# Altium project SpaceSystemsTaskII.PrjPcb
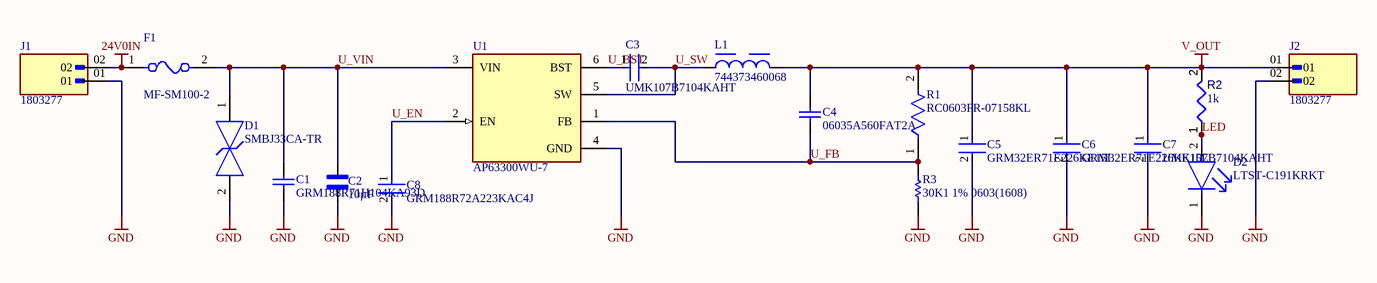
[diagram p0: Sheet2.SchDoc]
1 sheet, 18 parts. Net scope: global (net labels, ports and power ports of the same name join across sheets).
Board file: PCB_II.PcbDoc

## Sheet Sheet2.SchDoc
size A4; SheetNumber: 1; SheetTotal: 1

### Parts
C1  GRM188R71H104KA93D  [CAPC1608X90X35ML10T15]
C2  value 10µF  [CAPC3216X180N]  (hidden comment: GRM31CR71E106KA12L)
C3  UMK107B7104KAHT  [FP-0603-L_1_6_0_1-W_0_8_0-IPC_B]
C4  06035A560FAT2A  [CAPC1608X90X35NL15T15]
C5  GRM32ER71E226KE15L  [FP-GRM32E-0_3-0_2-MFG]
C6  GRM32ER71E226KE15L  [FP-GRM32E-0_3-0_2-MFG]
C7  UMK107B7104KAHT  [FP-0603-L_1_6_0_1-W_0_8_0-IPC_B]
C8  GRM188R72A223KAC4J  [FP-GRM188-0_1-e0_2_0_5-MFG]
D1  SMBJ33CA-TR  [FP-SMB-CA-MFG]
D2  LTST-C191KRKT  [FP-LTST-C191KRKT-MFG]
F1  MF-SM100-2  [FP-MF-SM100-2-MFG]
J1  1803277  [PHOENIX_1803277]
J2  1803277  [PHOENIX_1803277]
L1  744373460068  [WE-LHMI_7030]
R1  RC0603FR-07158KL  [FP-RC0603-0_55-MFG]
R2  value 1k  [RESC1608X55X25ML10T15]  (hidden comment: Resistor 1k +/-1% 0603 100 mW)
R3  30K1 1% 0603(1608)  [RESC0603(1608)_N]
U1  AP63300WU-7  [FP-TSOT26-IPC_A]

### Nets
24V0IN: F1.1 J1.02
GND: C1.1 C2.1 C5.2 C6.2 C7.2 C8.2 D1.2 D2.1(C) J1.01 J2.02 R3.1 U1.4(GND)
V_OUT: C4.2 C5.1 C6.1 C7.1 J2.01 L1.2 R1.2 R2.2
LED: D2.2(A) R2.1
U_BST: C3.1 U1.6(BST)
U_EN: C8.1 U1.2(EN)
U_FB: C4.1 R1.1 R3.2 U1.1(FB)
U_SW: C3.2 L1.1 U1.5(SW)
U_VIN: C1.2 C2.2 D1.1 F1.2 U1.3(VIN)

### Library data of the parts
C1 = CMP-2100-03643-1: Chip Capacitor, 0.1 uF, +/- 10%, 50 V, -55 to 125 degC, 0603 (1608 Metric), RoHS, Tape and Reel; Manufacturer: Murata; Dielectric Material: Ceramic; Voltage Rating: 50V; Capacitance: 100nF; Dielectric: X7R; Insulation Resistance: 10GR; Case Code (Metric): 1608; Lead Free: LeadFree; Depth: 0.8mm; Number of Pins: 2; Radiation Hardening: No; Case/Package: 0603; Manufacturer URL: http://www.murata.com/; Packaging: TapeandReel; Length: 1.6mm; Contact Plating: Tin; Datasheet URL: http://psearch.en.murata.com/capacitor/product/GRM188R71H104KA93%23.pdf; Tolerance: 10%; Case Code (Imperial): 0603; Min Operating Temperature: -55degC; RoHSCompliant: true; Voltage: 50V; Termination: SMD/SMT; Mount: SurfaceMount; Material: Ceramic; Package Quantity: 1; Height: 0.8mm; Thickness: 0.035inch; REACH SVHC: NoSVHC; Max Operating Temperature: 125degC; Width: 0.8mm; Package Reference: 0603; Voltage Rating (DC): 50V; Datasheet Version: 42675.0; Package Description: 2-Pin Surface Mount Device, Body 1.6 x 0.8 mm
C2 = CMP-001-00083-1: SMD capacitor X7R(EIA) with capacitance 10uF Tol.10%. Rated voltage 25Vdc 125C; MF: Murata Electronics; Design Item ID: GRM31CR71E106KA12L; Check_prices: https://www.snapeda.com/parts/GRM31CR71E106KA12L/Murata+Electronics+North+America/view-part/?ref=eda; SnapEDA_Link: https://www.snapeda.com/parts/GRM31CR71E106KA12L/Murata+Electronics+North+America/view-part/?ref=snap; Pins: 2; Case/Package: 1206 Murata; Source: GRM31CR71E106KA12L.SchLib; MP: GRM31CR71E106KA12L; Component Type: Standard
C3 C7 = CMP-14477-002598-2: None; Capacitance: 100nF; Voltage Rating: 50V; Dielectric: X7R; Tolerance: 10%; Ratings: AEC-Q200; Length: 0.063inch; Package Quantity: 4000; Thickness: 0.035inch; Case/Package: 0603; Width: 0.8mm; Termination: SMD/SMT; Max Operating Temperature: 125°C; Voltage Rating (DC): 50V; Case Code (Imperial): 0603; RoHS Compliant: Yes; Mount: Surface Mount; Height: 0.8mm; Case Code (Metric): 1608; Min Operating Temperature: -55°C; Packaging: Tape and Reel; Halogen Free: Halogen Free; Lead Free: Lead Free
C4 = CMP-2006-04334-1: Manufacturer: AVX Interconnect / Elco; Part Number: 06035A560FAT2A
C5 C6 = CMP-1662-00021-2: Chip Multilayer Ceramic Capacitors for General Purpose, 1210, 22uF, X7R, 15%, 10%, 25V; Capacitance: 22uF; Lead Free: Lead Free; Depth: 2.5mm; Mount: Surface Mount; Termination: SMD/SMT; Radiation Hardening: No; Package Quantity: 1; Dielectric: X7R; REACH SVHC: No SVHC; Voltage: 25V; Voltage Rating: 25V; Case Code (Metric): 3225; Tolerance: 10%; Number of Pins: 2; Packaging: Tape and Reel; Thickness: 0.106inch; Min Operating Temperature: -55°C; Length: 3.2mm; Voltage Rating (DC): 25V; Width: 0.098inch; Height: 2.5mm; Case Code (Imperial): 1210; Max Operating Temperature: 125°C; Material: Ceramic; Case/Package: 1210
C8 = CMP-06035-008498-1: Chip Multilayer Ceramic Capacitors for General Purpose, 0603, 22000pF, X7R, 15%, 10%, 100V; Capacitance: 22nF; Width: 0.031inch; Package Quantity: 10000; Tolerance: 10%; Packaging: Tape and Reel; Max Operating Temperature: 125°C; Thickness: 0.035inch; Case/Package: 0603; Voltage Rating: 100V; Dielectric: X7R; Length: 0.063inch; Mount: Surface Mount; Min Operating Temperature: -55°C; Voltage Rating (DC): 100V; Weight: 0.000222oz
D1 = CMP-12225-000040-1: TVS DIODE 33V 69.7V SMB; Manufacturer: STMicroelectronics; Direction: Bidirectional; Peak Pulse Current: 11.8A; Peak Pulse Power: 600W; Clamping Voltage: 53.3V; Breakdown Voltage: 36.7V; Number Of Channels: 1; Standoff Height: 0.05mm; Max Junction Temp: +150°C; Lead Free: Yes; Device Class L1: Circuit Protection; Device Class L3: unset; Mouser Description: TVS Diodes - Transient Voltage Suppressors 600W 33V Bidirect; Device Class L2: TVS Diodes; Temperature Range High: +150°C; Temperature: -55°C to +150°C; Temperature Range Low: -55°C; Octopart: https://octopart.com/smbj33ca-tr-stmicroelectronics-347069; Manufacturer Part Number: SMBJ33CA-TR; Automotive: No; ComponentLink2URL: https://www.st.com/resource/en/datasheet/smbj.pdf; RoHS: TRUE; Package: SMB-CA; Category: Diode; ComponentLink2Description: Datasheet; Height: 2.65mm; Reverse Standoff Voltage: 33V; Digikey Description: TVS DIODE 33V 69.7V SMB
D2 = CMP-2000-05199-2: NexarPartId: 549908; Illumination Color: Red; Lens Transparency: Clear; Luminous Intensity: 54mcd; Current: 2A; Forward Current: 20mA; Number of Elements: 1; Power Rating: 75mW; Lens Color: Colorless; Wavelength: 639nm; Viewing Angle: 130°; Voltage: 2V; Dominant Wavelength: 631nm; Reverse Voltage: 5V; Height: 550µm; Length: 1.6mm; Number of Pins: 2; Packaging: Tape and Reel; Mount: Surface Mount; Case Code (Metric): 1608; Radiation Hardening: No; Case Code (Imperial): 0603; Test Current: 20mA; Number of LEDs: 1; Schedule B: 8541402000, 8541402000; Lead Free: Lead Free; Power Dissipation: 75mW; RoHS: Compliant; Forward Voltage: 2V; Lens Style: Clear; Color: Red; Max Operating Temperature: 85°C; Depth: 800µm; Width: 800µm; Min Operating Temperature: -55°C; Case/Package: 0603
F1 = CMP-07400-000033-1: PTC RESET FUSE 30V 1.1A 2SMD; Manufacturer: Bourns; Trip Time: 0.5s; Current Rating: 80A; Trip Current: 2.2A; Value: 0.12-0.48Ω; Automotive Grade: Grade 3; Digikey Description: PTC RESET FUSE 30V 1.1A 2SMD; Temperature Range Low: -40°C; Octopart: https://octopart.com/mf-sm100-2-bourns-125561; Lead Free: Yes; Device Class L2: PTC Resettable Fuses; Ambient Temperature Range Low: -40°C; Voltage Rating: 30V; Hold Current: 1.1A; RoHS: TRUE; Height: 3mm; ComponentLink2URL: https://www.bourns.com/docs/Product-Datasheets/mfsm.pdf; Resistance: 0.12-0.48Ω; Device Class L3: unset; Mouser Description: Resettable Fuses - PPTC 30Volts 80Amps Hold 1.1A Trip 2.2A; Device Class L1: Circuit Protection; Automotive: Yes; ComponentLink2Description: Datasheet; Temperature: -40°C to +85°C; Category: Fuse; Package: MF-SM100-2; Manufacturer Part Number: MF-SM100-2; Temperature Range High: +85°C; Ambient Temperature Range High: +85°C
J1 J2 = CMP-002-00071-1: Pluggable Header 3.81mm 16AWG 160V 8A 2 Position COMBICON MC Series; MF: Phoenix Contact; MP: 1803277; Check_prices: https://www.snapeda.com/parts/1803277/Phoenix+Contact/view-part/?ref=eda; Design Item ID: 1803277; Value: *; Case/Package: None; SnapEDA_Link: https://www.snapeda.com/parts/1803277/Phoenix+Contact/view-part/?ref=snap; Component Type: Standard; Pins: 2; Source: 1803277.SchLib
L1 = CMP-1353-00050-5: NexarPartId: 21272415; Inductance: 680nH; Shielding: Shielded; Saturation Current: 15.9A; Current Rating: 11A; Tolerance: 20%; Core Material: Composite, Ferrite; Series Resistance: 5.5mΩ; Frequency: 72MHz; DC Resistance (DCR): 4.8mΩ; Test Frequency: 100kHz; Min Operating Temperature: -40°C; Max Operating Temperature: 125°C; Width: 6.6mm; REACH SVHC: Unknown; Height - Seated (Max): 2.9972mm; RoHS: Compliant; Ambient Temperature Range Low: -40°C; Mount: Surface Mount; Depth: 6.6mm; Height: 2.8mm; Packaging: Tape & Reel (TR); RMS Current (Irms): 11A; Termination: SMD/SMT; Composition: Wirewound; Max DC Current: 11A; Length: 7.3mm; Self Resonant Frequency: 72MHz; Ambient Temperature Range High: 85°C; Case/Package: Nonstandard; Inductance Tolerance: 20%; Number of Pins: 2
R1 = CMP-2000-04906-2: RES 158K OHM 1% 1/10W 0603; Working Voltage: 75V; Resistance: 158kR; Temperature Coefficient: 100ppm/°C; Voltage Rating: 50V; Power Rating: 100mW; Package Quantity: 5000; Case Code (Imperial): 0603; Technology: THICK FILM; Case/Package: 0603; Depth: 0.8mm; Number of Terminations: 2; RoHS Compliant: Yes; Length: 1.6mm; Termination: SMD/SMT; Min Operating Temperature: -55°C; Resistor Type: Thick Film; Tolerance: 1%; Packaging: Tape and Reel; Case Code (Metric): 1608; Construction: Rectangular; Series: RC; Lead Free: Lead Free; Max Operating Temperature: 155°C; Height: 0.45mm; Width: 0.8mm; Military Standard: Not; Voltage Rating (DC): 50V; Features: Moisture Resistant; Max Power Dissipation: 100mW
R2 = CMP-009-00014-5: Chip Resistor, 1 KOhm, +/-1%, 0.1 W, -55 to 155 degC, 0603 (1608 Metric); Voltage Rating: 50V; Power: 100mW; Tolerance: 1%; Mounting Technology: SM; Pins: 2; Case/Package: 0603; Min Operating Temperature: -55°C; RoHS Compliant: True; Max Operating Temperature: 155°C
R3 = CMP-1012-00676-1: 30K1 0.1W 1% 0603 (1608 Metric)  SMD; Case-Metric: 1608; Case-EIA: 0603; Value: 30100.00 Ohm; Tolerance: 1 %; Power: 0.1 W; Technology: SMT
U1 = CMP-12757-000025-1: DCDC CONV HV BUCK TSOT26